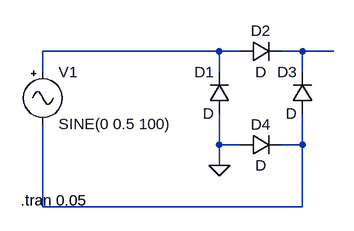
[diagram p0: schematic Brückenschaltung.asc]
Brückenschaltung.asc, the LTspice schematic file:
Version 4
SHEET 1 880 680
WIRE 272 112 0 112
WIRE 304 112 272 112
WIRE 400 112 368 112
WIRE 448 112 400 112
WIRE 0 144 0 112
WIRE 272 144 272 112
WIRE 400 144 400 112
WIRE 272 256 272 208
WIRE 304 256 272 256
WIRE 400 256 400 208
WIRE 400 256 368 256
WIRE 272 288 272 256
WIRE 0 352 0 224
WIRE 400 352 400 256
WIRE 400 352 0 352
FLAG 272 288 0
SYMBOL Misc\\signal 0 128 R0
WINDOW 123 0 0 Left 2
WINDOW 39 0 0 Left 2
SYMATTR InstName V1
SYMATTR Value SINE(0 0.5 100)
SYMBOL diode 288 208 R180
WINDOW 0 24 64 Left 2
WINDOW 3 24 0 Left 2
SYMATTR InstName D1
SYMBOL diode 304 128 R270
WINDOW 0 32 32 VTop 2
WINDOW 3 0 32 VBottom 2
SYMATTR InstName D2
SYMBOL diode 416 208 R180
WINDOW 0 24 64 Left 2
WINDOW 3 24 0 Left 2
SYMATTR InstName D3
SYMBOL diode 304 272 R270
WINDOW 0 32 32 VTop 2
WINDOW 3 0 32 VBottom 2
SYMATTR InstName D4
TEXT -34 342 Left 2 !.tran 0.05

The netlist it stands for:
* Brückenschaltung.asc
V1 N001 N003 SINE(0 0.5 100)
D1 0 N001 D
D2 N001 N002 D
D3 N003 N002 D
D4 0 N003 D
.model D D
.lib standard.dio
.tran 0.05
.backanno
.end